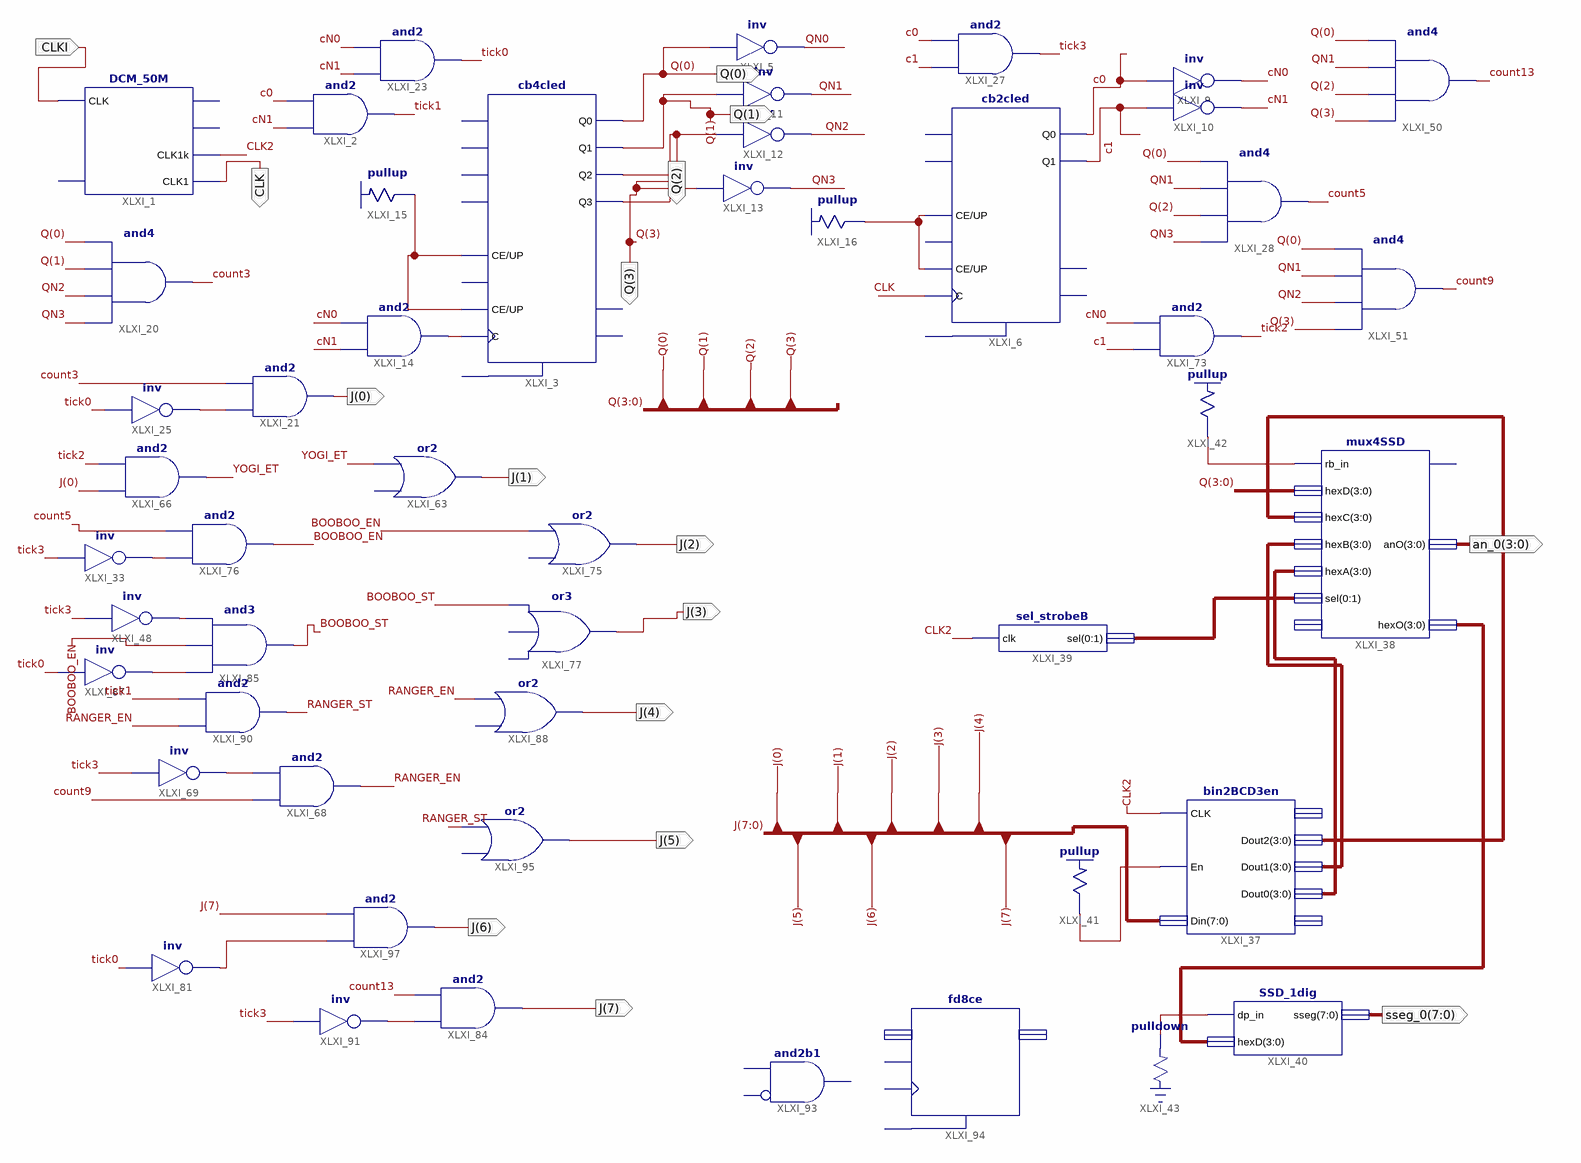
[diagram p0: schematic sheet 1]
// Xilinx ISE schematic ExpThree (1).sch (spartan3e) as structural Verilog: 49 symbols, 16 ports
module \ExpThree_(1)  (
  input  CLKI,
  output CLK,
  output [7:0] J,
  output [7:0] sseg_0,
  output [3:0] an_0,
  output [3:0] Q
);

  wire BOOBOO_EN, BOOBOO_ST, c0, c1, CLK2, cN0, cN1, count3, count5, count9, count13, QN0, QN1, QN2, QN3,
       RANGER_EN, RANGER_ST, tick0, tick1, tick2, tick3, XLXN_39, XLXN_40, XLXN_42, XLXN_83, XLXN_95,
       XLXN_158, XLXN_159, XLXN_163, XLXN_210, XLXN_215, XLXN_251, XLXN_254, XLXN_264, YOGI_ET;
  wire [1:0] XLXN_226;
  wire [3:0] XLXN_145, XLXN_146, XLXN_147, XLXN_154;

  DCM_50M XLXI_1 (.CLK(CLKI), .CLK1k(CLK2), .CLK1(CLK));  // open: RST, CLK1M, CLK10k
  and XLXI_2 (tick1, cN1, c0);
  cb4cled XLXI_3 (
    .C(XLXN_39), .CE(XLXN_40), .UP(XLXN_40), .Q0(Q[0]), .Q1(Q[1]), .Q2(Q[2]), .Q3(Q[3]));  // open: CLR, D0, D1, D2, D3, L, CEO, TC
  not XLXI_5 (QN0, Q[0]);
  cb2cled XLXI_6 (.C(CLK), .CE(XLXN_42), .UP(XLXN_42), .Q0(c0), .Q1(c1));  // open: CLR, D0, D1, L, CEO, TC
  not XLXI_9 (cN0, c0);
  not XLXI_10 (cN1, c1);
  not XLXI_11 (QN1, Q[1]);
  not XLXI_12 (QN2, Q[2]);
  not XLXI_13 (QN3, Q[3]);
  and XLXI_14 (XLXN_39, cN1, cN0);
  \pullup  XLXI_15 (.O(XLXN_40));
  \pullup  XLXI_16 (.O(XLXN_42));
  and XLXI_20 (count3, QN3, QN2, Q[1], Q[0]);
  and XLXI_23 (tick0, cN1, cN0);
  not XLXI_25 (XLXN_83, tick0);
  and XLXI_27 (tick3, c1, c0);
  and XLXI_28 (count5, QN3, Q[2], QN1, Q[0]);
  not XLXI_33 (XLXN_95, tick3);
  bin2BCD3en XLXI_37 (
    .CLK(CLK2), .En(XLXN_158), .Din(J), .Dout2(XLXN_145), .Dout1(XLXN_146), .Dout0(XLXN_147));  // open: Dout3, RBout
  mux4SSD XLXI_38 (
    .rb_in(XLXN_159), .hexD(Q), .hexC(XLXN_145), .hexB(XLXN_146), .hexA(XLXN_147),
    .sel({XLXN_226[0], XLXN_226[1]}), .anO(an_0), .hexO(XLXN_154));  // open: dp_in, dpO
  sel_strobeB XLXI_39 (.clk(CLK2), .sel({XLXN_226[0], XLXN_226[1]}));
  SSD_1dig XLXI_40 (.dp_in(XLXN_163), .hexD(XLXN_154), .sseg(sseg_0));
  \pullup  XLXI_41 (.O(XLXN_158));
  \pullup  XLXI_42 (.O(XLXN_159));
  \pulldown  XLXI_43 (.O(XLXN_163));
  not XLXI_48 (XLXN_215, tick3);
  and XLXI_50 (count13, Q[3], Q[2], QN1, Q[0]);
  and XLXI_51 (count9, Q[3], QN2, QN1, Q[0]);
  and XLXI_21 (J[0], XLXN_83, count3);
  buf XLXI_63 (J[1], YOGI_ET);  // or2 open: I0
  and XLXI_66 (YOGI_ET, J[0], tick2);
  and XLXI_68 (RANGER_EN, count9, XLXN_210);
  not XLXI_69 (XLXN_210, tick3);
  and XLXI_73 (tick2, c1, cN0);
  buf XLXI_75 (J[2], BOOBOO_EN);  // or2 open: I0
  and XLXI_76 (BOOBOO_EN, XLXN_95, count5);
  buf XLXI_77 (J[3], BOOBOO_ST);  // or3 open: I0, I1
  not XLXI_81 (XLXN_251, tick0);
  and XLXI_84 (J[7], XLXN_264, count13);
  and XLXI_85 (BOOBOO_ST, XLXN_254, BOOBOO_EN, XLXN_215);
  not XLXI_87 (XLXN_254, tick0);
  buf XLXI_88 (J[4], RANGER_EN);  // or2 open: I0
  and XLXI_90 (RANGER_ST, RANGER_EN, tick1);
  not XLXI_91 (XLXN_264, tick3);
  // and2b1 XLXI_93 is placed but not wired
  fd8ce XLXI_94 ();  // open: C, CE, CLR, D, Q
  buf XLXI_95 (J[5], RANGER_ST);  // or2 open: I0
  and XLXI_97 (J[6], XLXN_251, J[7]);
endmodule
